# Altium schematic sheet PD_Receiver_Circuit.SchDoc: Receiver amplifier
size A3; Author: Agni, Peter; SheetNumber: 4; SheetTotal: 9; SPICEModelCacheSWUYWAZA: <root> / <DocumentId>SWUYWAZA</DocumentId> / </root>
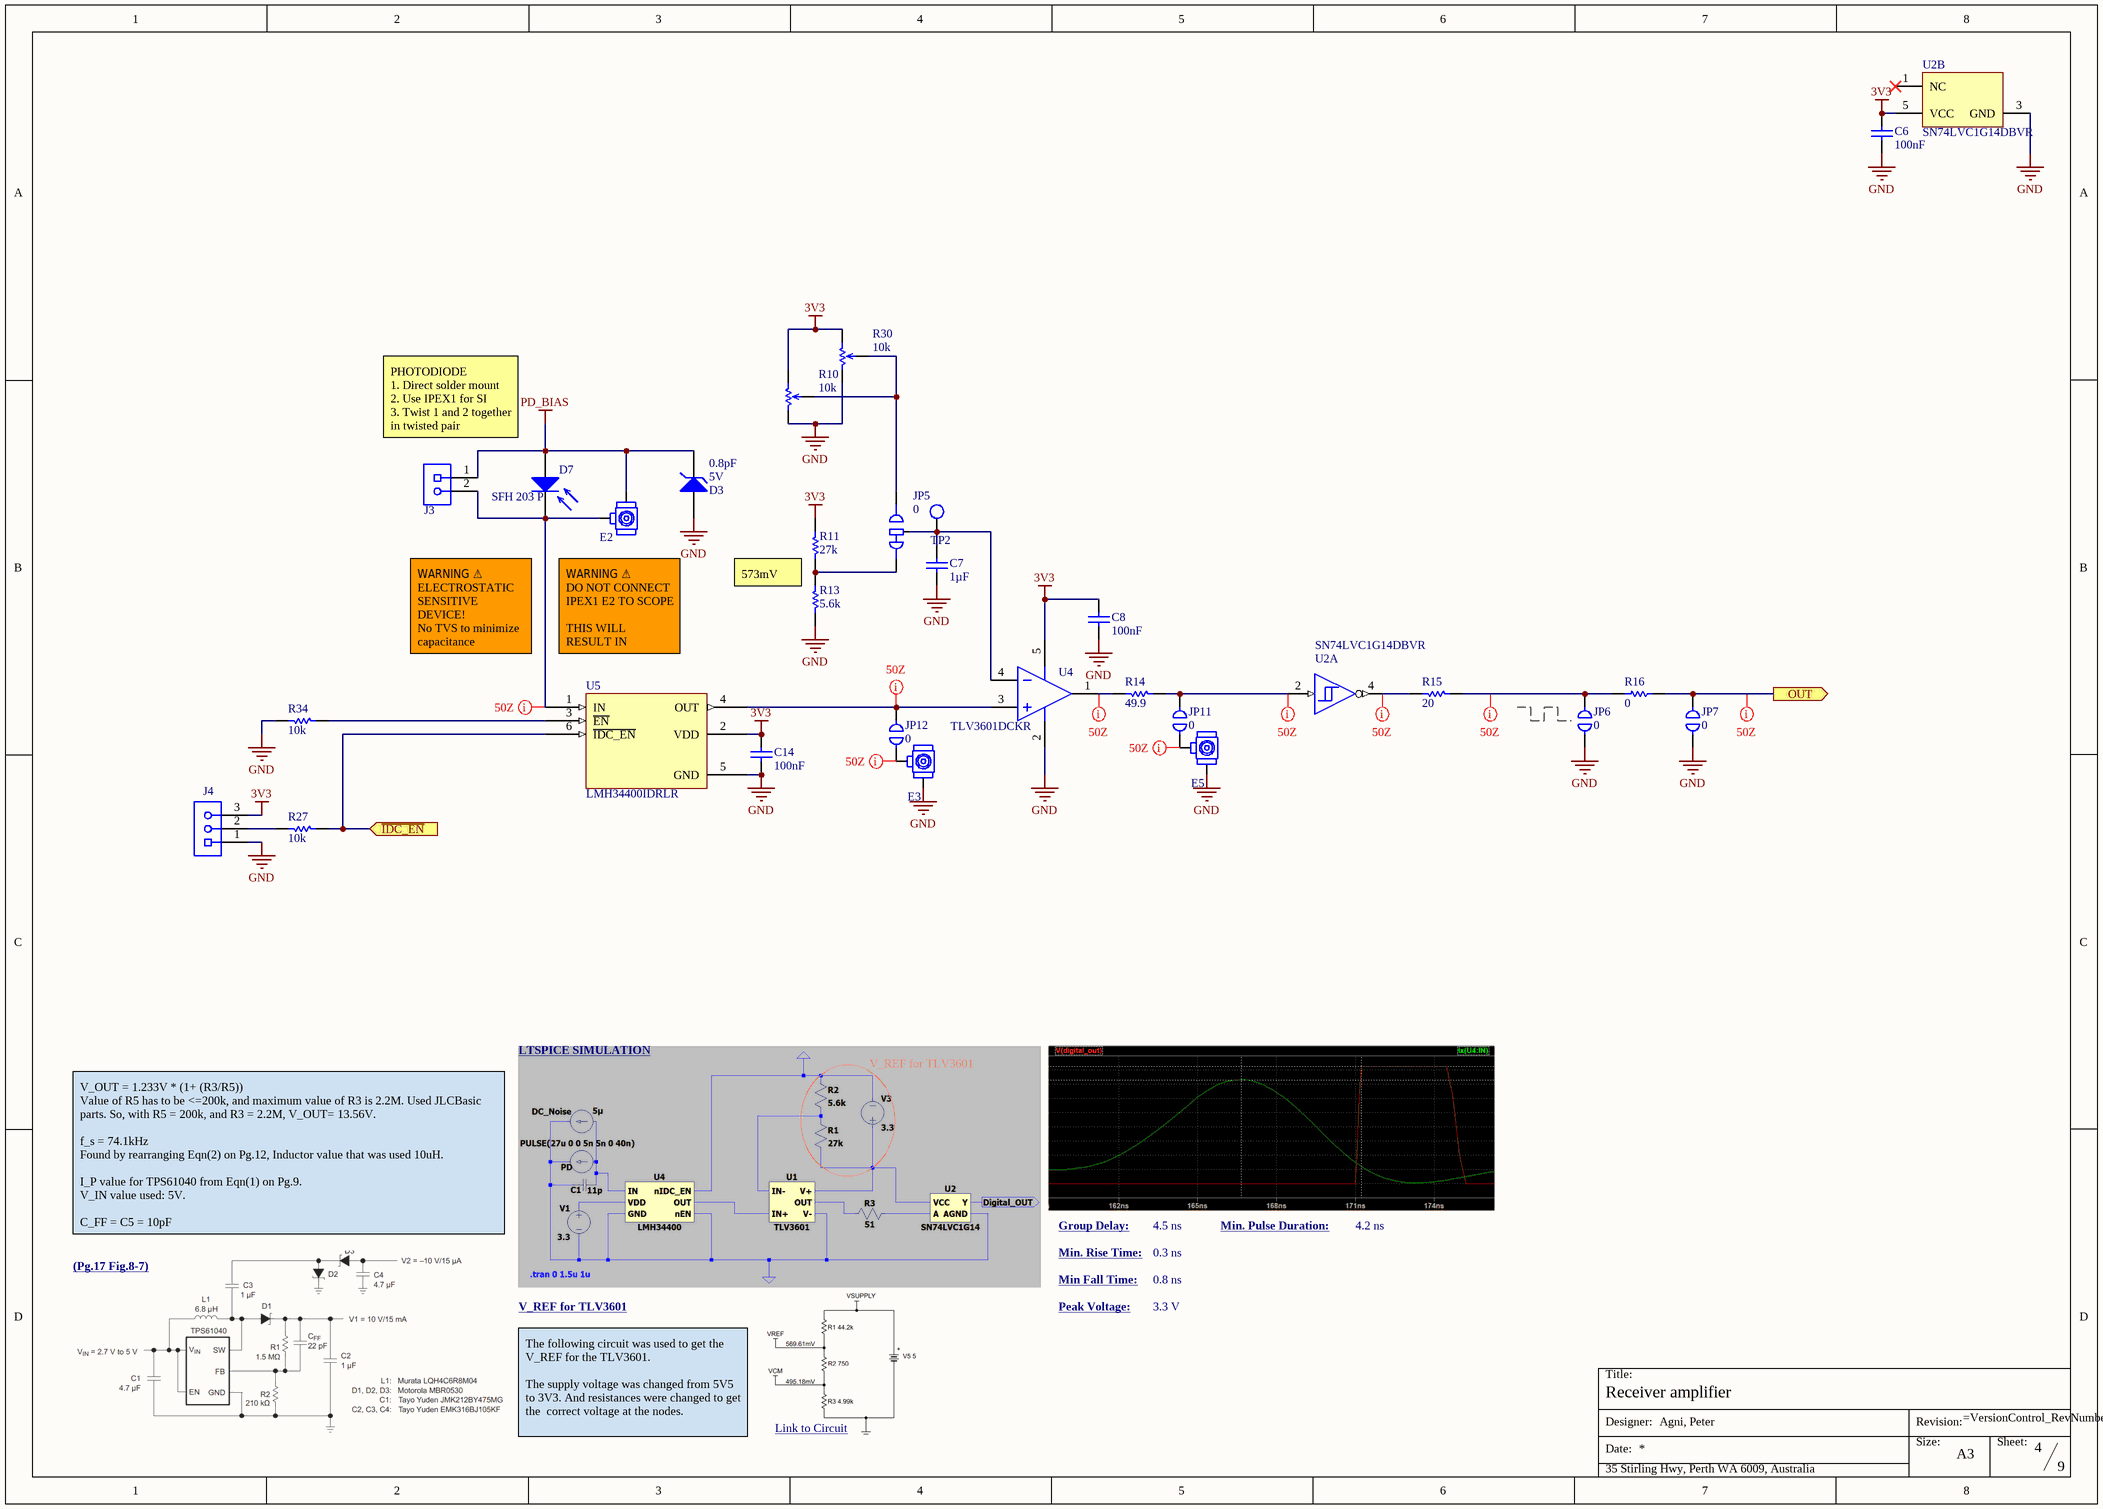
[diagram p0: PD_Receiver_Circuit.SchDoc]

## Parts
C6  value 100nF  [CAPC1005X06N]  (hidden comment: CL05B104KB54PNC)
C7  value 1µF  [CAPC1005X06N]  (hidden comment: CL05A105KA5NQNC)
C8  value 100nF  [CAPC1005X06N]  (hidden comment: CL05B104KB54PNC)
C14  value 100nF  [CAPC1005X06N]  (hidden comment: CL05B104KB54PNC)
D3  value 5V  Capacitance: 0.8pF  [DFN60P100X45-2L]  (hidden comment: H5VU10U)
D7  SFH 203 P  [SFH203P]
E2  U.FL-R-SMT-1(01)  [HRS-U.FL-R-SMT-3_V 4_LAYER_KO]  (value not drawn)
E3  U.FL-R-SMT-1(01)  [HRS-U.FL-R-SMT-3_V 4_LAYER_KO]  (value not drawn)
E5  U.FL-R-SMT-1(01)  [HRS-U.FL-R-SMT-3_V 4_LAYER_KO]  (value not drawn)
J3  B2B-PH-K-S(LF)(SN)  [JST_B2B-PH-K-S(LF)(SN)]  (value not drawn)
J4  10129378-903001BLF  [10129378-903001BLF-Footprint-1]  (value not drawn)
JP5  value 0  [RESC1005X04N TWO STATE]  (hidden comment: JUMPER-0402 TWO STATE)
JP6  value 0  [RESC1005X04N]  (hidden comment: JUMPER-0402)  (no BOM)
JP7  value 0  [RESC1005X04N]  (hidden comment: JUMPER-0402)  (no BOM)
JP11  value 0  [RESC1005X04N]  (hidden comment: JUMPER-0402)  (no BOM)
JP12  value 0  [RESC1005X04N]  (hidden comment: JUMPER-0402)  (no BOM)
R10  value 10k  [BOUR-TC33X-2_V]  (hidden comment: TC33X-2-103E)
R11  value 27k  [RESC1005X04N]  (hidden comment: 0402WGF2702TCE)
R13  value 5.6k  [RESC1005X04N]  (hidden comment: 0402WGF5601TCE)
R14  value 49.9  [RESC1005X04N]  (hidden comment: 0402WGF499JTCE)
R15  value 20  [RESC1608X05N]  (hidden comment: 0603WAF200JT5E)
R16  value 0  [RESC1005X04N]  (hidden comment: 0402WGF0000TCE)
R27  value 10k  [RESC1005X04N]  (hidden comment: CRCW0402-10K0FKED)
R30  value 10k  [POT_RK0971-L-15KC_N-1]  (hidden comment: RK0971114D0B)
R34  value 10k  [RESC1005X04N]  (hidden comment: CRCW0402-10K0FKED)
TP2  Test Point 5001  [FP-5001-MFG]  (value not drawn)
U2  SN74LVC1G14DBVR  [DBV0005A_N]  (parts A,B of 2)
U4  TLV3601DCKR  [DCK0005A_SC-70-5_TI_SOT65P210X110-5N]
U5  LMH34400IDRLR  [SOTFL50P160X60-6N]

## Ports
OUT (out), ~{IDC_EN} (in)

## Nets
3V3: C6.2 C8.2 C14.2 J4.3 R10.3(CW) R11.2 R30.3(CW) U2.5(VCC) U4.5(V+) U5.2(VDD)
GND: C6.1 C7.1 C8.1 C14.1 D3.2(A) E3.2(GND) E5.2(GND) J4.1 JP6.1 JP7.1 R10.1(CCW) R13.1 R30.1(CCW) R34.2 U2.3(GND) U4.2(V-) U5.5(GND)
PD_BIAS: D3.1(K) D7.2(A) E2.2(GND) J3.1
~{IDC_EN}: R27.1 U5.6(~{IDC_EN}) ; port ~{IDC_EN}
OUT: JP7.2 R16.1 ; port OUT
NetC7_2: C7.2 JP5.3(COM) TP2.1 U4.4(IN-)
NetD7_1: D7.1(K) E2.1(SIG) J3.2 U5.1(IN)
NetE3_1: E3.1(SIG) JP12.1
NetE5_1: E5.1(SIG) JP11.1
NetJ4_2: J4.2 R27.2
NetJP5_1: JP5.1 R10.2(W) R30.2(W)
NetJP5_2: JP5.2 R11.1 R13.2
NetJP6_2: JP6.2 R15.2 R16.2
NetJP11_2: JP11.2 R14.2 U2.2(A)
NetJP12_2: JP12.2 U4.3(IN+) U5.4(OUT)
NetR14_1: R14.1 U4.1(OUT)
NetR15_1: R15.1 U2.4(Y)
NetR34_1: R34.1 U5.3(~{EN})

Not connected (* = marked no-connect by the designer): U2 1(NC)*

## Layout directives
net class 50Z: NetD7_1, NetE3_1, NetE5_1, NetJP6_2, NetJP11_2, NetJP12_2, NetR14_1, NetR15_1, OUT

## Notes on the sheet
- PHOTODIODE
  1. Direct solder mount
  2. Use IPEX1 for SI
  3. Twist 1 and 2 together in twisted pair
- 573mV
- WARNING ⚠
  ELECTROSTATIC SENSITIVE DEVICE!
  No TVS to minimize capacitance
  Avoid contact
- WARNING ⚠
  DO NOT CONNECT IPEX1 E2 TO SCOPE
  THIS WILL RESULT IN SHORT-CIRCUIT
- LTSPICE SIMULATION
- V_REF for TLV3601
- V_OUT = 1.233V * (1+ (R3/R5))
  Value of R5 has to be <=200k, and maximum value of R3 is 2.2M. Used JLCBasic parts. So, with R5 = 200k, and R3 = 2.2M, V_OUT= 13.56V.
  f_s = 74.1kHz
  Found by rearranging Eqn(2) on Pg.12, Inductor value that was used 10uH.
  I_P value for TPS61040 from Eqn(1) on Pg.9.
  V_IN value used: 5V.
  C_FF = C5 = 10pF
  C5 = 1/(2*pi*(f_s/20)*R1)
- Group Delay:
- Min. Rise Time:
- 4.5 ns
- 0.3 ns
- Min. Pulse Duration:
- 4.2 ns
- (Pg.17 Fig.8-7) <https://www.ti.com/lit/ds/symlink/tps61041.pdf>
- Min Fall Time:
- Peak Voltage:
- 0.8 ns
- 3.3 V
- The following circuit was used to get the V_REF for the TLV3601.
  The supply voltage was changed from 5V5 to 3V3. And resistances were changed to get the  correct voltage at the nodes.
- Link to Circuit <https://www.ti.com/lit/ab/snoaa83/snoaa83.pdf?ts=1756539067414&ref_url=https%253A%252F%252Fwww.ti.com%252F>
- Title:
- Designer:
- Date:
- Size:
- Revision:
- A3
- Sheet:
- 35 Stirling Hwy, Perth WA 6009, Australia

## Library data of the parts
C6 C8 C14 = CMP-00074-10: Ceramic Capacitor, Multilayer, Ceramic, 50V, 10% +Tol, 10% -Tol, X7R, 15% TC, 0.1uF, Surface Mount, 0402; Dielectric: X7R; RoHS Compliant: Yes; Case Code (Imperial): 0402; Tolerance: 10%; JLC_PN: C307331; Voltage Rating: 50V; Source: JLCPCB(Basic)
C7 = CMP-00190-9: Ceramic Capacitor, Multilayer, Ceramic, 25V, 10% +Tol, 10% -Tol, X5R, 15% TC, 1uF, Surface Mount, 0402; JLC_PN: C52923; RoHS Compliant: Yes; Source: JLCPCB(Basic); Voltage Rating: 25V; Case Code (Imperial): 0402; Dielectric: X5R; Tolerance: 10%
D3 = CMP-00841-4: 5A 55W 16V 9V Unidirectional 5V DFN1006-2L  ESD and Surge Protection (TVS/ESD) ROHS; Breakdown Voltage: 9V; Source: JLCPCB(Basic); JLC_PN: C22395519; Polarity: Unidirectional; RoHS Compliant: Unsure; Package: DFN1006-2L; Peak Pulse Power Dissipation: 55W; Clamping Voltage: 16V
D7 = CMP-111-000002-3: Photodiode PIN Chip 850nm 0.62A/W Sensitivity 2-Pin T-1 3/4; Forward Voltage: 1.3V; Shape: Square; Max Power Dissipation: 150mW; Reverse Voltage: 20V; Fall Time: 5ns; Max Reverse Voltage (DC): 50V; Viewing Angle: 150°; Forward Current: 80mA; Number of Circuits: 1; Dark Current: 5nA; Max Reverse Current: 0A; Max Repetitive Reverse Voltage (Vrrm): 0V; Technology: 0; Peak Wavelength: 850nm; RoHS Compliant: Unsure; Case/Package: Radial; Contact Plating: Tin; Wavelength: 850nm; Rise Time: 5ns; Pins: 2; Height: 4.6mm; Power Dissipation: 150mW; Length: 5.7mm; Source: Distributor; Reverse Voltage (DC): 50V; Width: 5.7mm; Reverse Breakdown Voltage: 50V; Mounting Technology: Through Hole; Max Forward Surge Current (Ifsm): 0A; Diode Type: PIN; Max Operating Temperature: 100°C; Response Time: 5ns; RoHS: Compliant; Min Operating Temperature: -40°C
E2 E3 E5 = CMP-00380-18: Rf Connectors / Coaxial Connectors SMT Ml Rec Au 50 Ohm W/anti Sldr Wicking UFL; Number of Ports: 1; Dielectric Material: Polymer; Impedance: 50; Mating Cycles: 30; Connector Type: Receptacle,Male Pin; Body Plating: Silver; Center Contact Plating: Gold; Max Frequency: 6GHz; Body Material: Bronze; Lead Free: Lead Free; Series: U.FL; JLC PN: C88374; Contact Material: Brass; Fastening Type: SNAP-ON; Min Operating Temperature: -40°C; RoHS Compliant: Yes; Housing Color: Beige; Depth: 3mm; Contact Plating: Gold; Mount: Surface Mount; Length: 3.1mm; Orientation: Vertical; Termination: Solder; Max Operating Temperature: 90°C; Source: UWAA_Stock
J3 = CMP-00690-1: Board Connector, 2 Contact(s), 1 Row(s), Male, Straight, 0.079 inch Pitch, Solder Terminal, Locking, Natural Insulator
J4 = CMP-00188-3: Conn Unshrouded Header HDR 3 POS 2.54mm Solder ST Thru-Hole Poly Bag; RoHS Compliant: Unsure; Source: Aliexpress
JP5 = CMP-009-00003-3: JUMPER-0402 TWO STATE Fixed Resistor, Metal Glaze/thick Film, 0.1W, 0ohm, Surface Mount, 0402; Tolerance: 1%; Power Rating: 100mW; Source: JLCPCB(Basic); JLC_PN: C17168; Case Code (Imperial): 0402; RoHS Compliant: Yes
JP6 JP7 JP11 JP12 = CMP-009-00001-6: 0402 pad placeholder for 0-ohm resistor jumper; Tolerance: 1%; RoHS Compliant: Unsure; Source: Distributor; Case Code (Imperial): 0402
R10 = CMP-00586-3: Res Trimmer 10K Ohm 25% 1/10W 1(Elec)/1(Mech)Turn (3 X 3.8mm) Foot Print SMD Embossed T/R; Temperature Coefficient: 250ppm/°C; Power Rating: 100mW; Case Code (Imperial): 0402; Source: JLCPCB(Basic); Tolerance: 25%; RoHS Compliant: Unsure
R11 = CMP-077-000030-1: Res Thick Film 0402 27K Ohm 1% 0.063W(1/16W) ±100ppm/C Pad SMD T/R; Voltage Rating: 50V; Temperature Coefficient: 100ppm/°C; Power Rating: 62.5mW; Tolerance: 1%; Source: JLCPCB(Basic); Case Code (Imperial): 0402; JLC_PN: C25771; RoHS Compliant: Unsure
R13 = CMP-077-000031-1: 62.5mW Thick Film Resistors 50V ±100ppm/℃ ±1% 5.6kΩ 0402 Chip Resistor - Surface Mount ROHS; Temperature Coefficient: 100ppm/°C; Tolerance: 1%; Case Code (Imperial): 0402; Power Rating: 62.5mW; RoHS Compliant: Unsure; Source: JLCPCB(Basic); JLC_PN: C25908; Voltage Rating: 50V
R14 = CMP-077-000018-1: 62.5mW Thick Film Resistors 50V ±100ppm/℃ ±1% 49.9Ω 0402 Chip Resistor - Surface Mount ROHS; Temperature Coefficient: 200ppm/°C; Power Rating: 62.5mW; Tolerance: 1%; Source: JLCPCB(Basic); RoHS Compliant: Yes; JLC_PN: C25120; Case Code (Imperial): 0402
R15 = CMP-077-000029-1: Res Thick Film 0603 20 Ohm 1% 0.1W(1/10W) ±200ppm/C Pad SMD T/R; Power Rating: 100mW; Voltage Rating: 75V; Temperature Coefficient: 100ppm/℃; Tolerance: 1%; RoHS Compliant: Yes; Source: JLCPCB(Basic); Case Code (Imperial): 0603; JLC_PN: C22950
R16 = CMP-00817-3: Metal Glaze/thick Film, 0.0625W, 0ohm, 0402; Tolerance: 1%; JLC_PN: C17168; RoHS Compliant: Unsure; Case Code (Imperial): 0402; Source: JLCPCB(Basic)
R27 R34 = CMP-00515-7: Res Thick Film 0402 10K Ohm 1% 1/16W ±100ppm/°C Molded SMD Paper T/R; Voltage Rating: 50V; Power Rating: 63mW; RoHS Compliant: Unsure; JLC_PN: C25744; Source: JLCPCB(Basic); Tolerance: 1%; Case Code (Imperial): 0402; Temperature Coefficient: 100ppm/°C
R30 = CMP-077-000032-3: Potentiometer, 0.05W, 10000ohm, 10V, 20% +/-Tol, 1 Turn(s); Power Rating: 50mW; RoHS Compliant: Unsure; Case Code (Imperial): N/A; Voltage Rating: 10V; Tolerance: 20%; Source: Aliexpress
TP2 = CMP-001-0013-1: MS27478 - Connectors Receptacle Electrical Solder Mounting Solder Type Hermetic Seal 38999 Series II Test Point; Voltage Rating: 0V; Current Rating: 0A; Number of Contacts: 1; Contact Material: Silver; RoHS Compliant: Unsure; Housing Color: Black; Height: 4.72mm; Length: 7.62mm; Orientation: Straight; Termination: Through Hole; Gender: -; Mounting Technology: Through Hole; Number of Rows: 1; Source: UWAA_Stock; Contact Plating: Tin
U2 = CMP-071-000015-2: Single 1.65-V to 5.5-V inverter with Schmitt-Trigger inputs 5-SOT-23 -40 to 125; Manufacturer Lifecycle Status: ACTIVE; Logic Function: Inverting; Low Level Output Current: 32mA; Quiescent Current: 10µA; High Level Output Current: -32mA; Number of Gates: 1; Turn-On Delay Time: 11ns; Max Junction Temperature (Tj): 150°C; Max Supply Voltage: 5.5V; Min Supply Voltage: 1.65V; Mounting Technology: Surface Mount; Max Operating Temperature: 125°C; Lifecycle Status: Production; Lead Free: Lead Free; Length: 2.9mm; Max Output current: 32mA; Termination: SMD/SMT; Number of Elements: 1; Number of Circuits: 1; Number of Channels: 1; Case/Package: SOT-23; Schedule B: 8542390000, 8542390000; JLC_PN: C7835; Weight: 15.790684mg; Thickness: 1.2mm; Output Current: 32mA; Number of Outputs: 1; RoHS: Compliant; Radiation Hardening: No; Packaging: Cut Tape; Contact Plating: Tin; Source: Distributor; Number of Bits: 1; REACH SVHC: No; Propagation Delay: 11ns; Width: 1.6mm; Number of Inputs: 1; Pins: 5; Min Operating Temperature: -40°C; Height: 1.45mm
U4 = CMP-00909-3: 2.5-ns high-speed rail-to-rail comparator with push-pull outputs 5-SC70 -40 to 125; Manufacturer Lifecycle Status: ACTIVE; Number of Channels: 1; RoHS: Compliant; Width: 1.25mm; Lifecycle Status: Production; JLC_PN: C2974371; Length: 2mm; Source: JLCPCB(Extended,Economic_PCBA); Pins: 5; RoHS Compliant: Unsure; Height: 1.1mm; Thickness: 900µm
U5 = CMP-00906-2: "240-MHZ, Single-ended, Transimpe" Transimpedance Amplifier IC SOT-563; Manufacturer Lifecycle Status: ACTIVE; Lifecycle Status: Production; RoHS: Compliant; Length: 1.6mm; JLC_PN: C19723951; Width: 1.2mm; Height: 600µm; Thickness: 550µm; Pins: 6; Source: JLCPCB(Extended,Economic_PCBA)